# Altium project Dahlia Carrier Board.PrjPcb (part 4 of 4)

## Sheet USB_Debug.SchDoc: Dahlia Carrier Board
size A3; Organization: Toradex AG; Address1: Ebenaustrasse 10; Address2: Horw; Address3: 6048; Address4: Switzerland; DocumentNumber: 19; Revision: V1.1; SheetNumber: 19; SheetTotal: 21; PageSetup: Record=PageOptions|CenterHorizontal=True|CenterVertical=True|PrintScale=0.71|XCorrection=1.00|YCorrection=1.00|PrintKind=1|BorderSize=5000000|LeftOffset=0|BottomOffset=0|Orientation=2|PaperLength=1000|PaperWidth=1000|Scale=100|PaperSource=15|PrintQuality=600|MediaType=1|DitherType=10|PaperKind=A4|PrintScaleMode=1
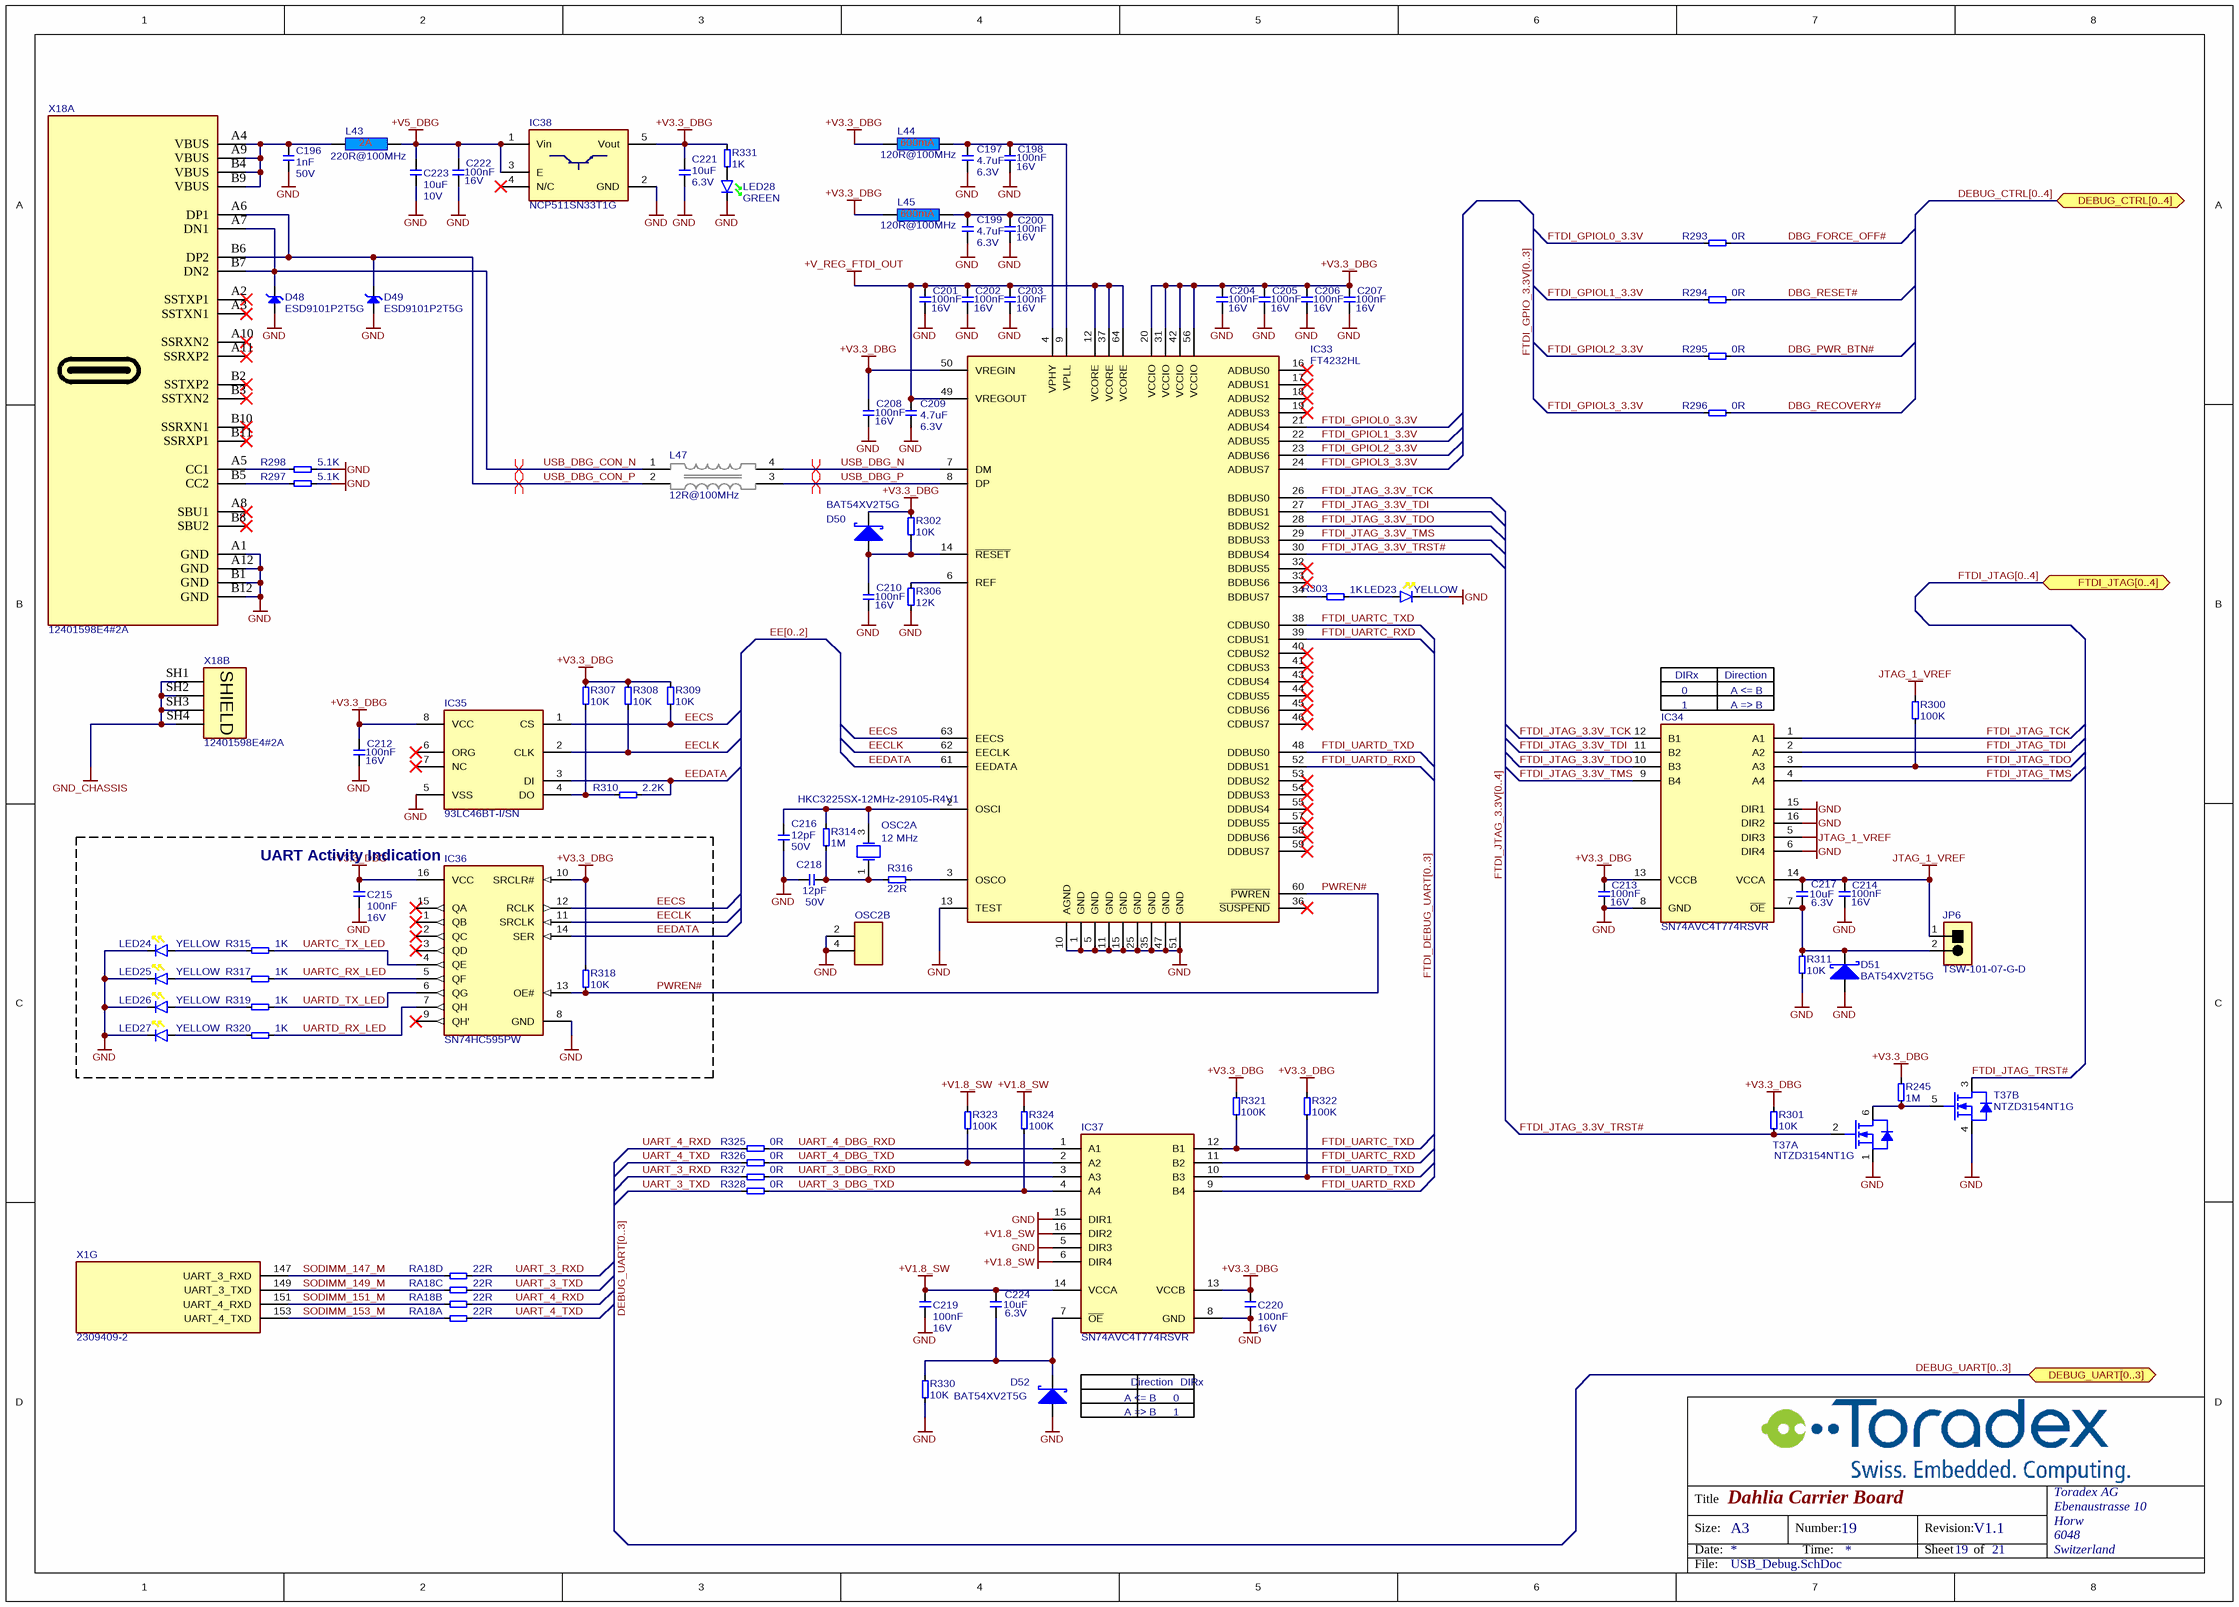
[diagram p17: USB_Debug.SchDoc]

### Parts
C196  Rating: 50V  [CAPC1005X60N]  (hidden comment: 1nF)
C197  Rating: 6.3V  [CAPC1005X60N]  (hidden comment: 4.7uF)
C198  Rating: 16V  [CAPC1005X60N]  (hidden comment: 100nF)
C199  Rating: 6.3V  [CAPC1005X60N]  (hidden comment: 4.7uF)
C200  Rating: 16V  [CAPC1005X60N]  (hidden comment: 100nF)
C201  Rating: 16V  [CAPC1005X60N]  (hidden comment: 100nF)
C202  Rating: 16V  [CAPC1005X60N]  (hidden comment: 100nF)
C203  Rating: 16V  [CAPC1005X60N]  (hidden comment: 100nF)
C204  Rating: 16V  [CAPC1005X60N]  (hidden comment: 100nF)
C205  Rating: 16V  [CAPC1005X60N]  (hidden comment: 100nF)
C206  Rating: 16V  [CAPC1005X60N]  (hidden comment: 100nF)
C207  Rating: 16V  [CAPC1005X60N]  (hidden comment: 100nF)
C208  Rating: 16V  [CAPC1005X60N]  (hidden comment: 100nF)
C209  Rating: 6.3V  [CAPC1005X60N]  (hidden comment: 4.7uF)
C210  Rating: 16V  [CAPC1005X60N]  (hidden comment: 100nF)
C212  Rating: 16V  [CAPC1005X60N]  (hidden comment: 100nF)
C213  Rating: 16V  [CAPC1005X60N]  (hidden comment: 100nF)
C214  Rating: 16V  [CAPC1005X60N]  (hidden comment: 100nF)
C215  Rating: 16V  [CAPC1005X60N]  (hidden comment: 100nF)
C216  Rating: 50V  [CAPC1005X60N]  (hidden comment: 12pF)
C217  Rating: 6.3V  [CAPC1005X60N]  (hidden comment: 10uF)
C218  Rating: 50V  [CAPC1005X60N]  (hidden comment: 12pF)
C219  Rating: 16V  [CAPC1005X60N]  (hidden comment: 100nF)
C220  Rating: 16V  [CAPC1005X60N]  (hidden comment: 100nF)
C221  Rating: 6.3V  [CAPC1005X60N]  (hidden comment: 10uF)
C222  Rating: 16V  [CAPC1005X60N]  (hidden comment: 100nF)
C223  Rating: 10V  [T_CAPC0603X33N]  (hidden comment: 10uF)
C224  Rating: 6.3V  [CAPC1005X60N]  (hidden comment: 10uF)
D48  ESD9101P2T5G  [SOD-923]
D49  ESD9101P2T5G  [SOD-923]
D50  BAT54XV2T5G  [SOD-523]
D51  BAT54XV2T5G  [SOD-523]
D52  BAT54XV2T5G  [SOD-523]
IC33  FT4232HL  [LQFP-64]
IC34  SN74AVC4T774RSVR  [IC-UQFN40P180X210X55-16N]
IC35  Manufacturer Part No.: 93LC46BT-I/SN  [SOIC127P600X173-8N]  (hidden comment: 93LC46BT)
IC36  SN74HC595PW  [IC_TSOP65P640X120-16N]
IC37  SN74AVC4T774RSVR  [IC-UQFN40P180X210X55-16N]
IC38  NCP511SN33T1G  [SOT95P279X142-5N]
JP6  TSW-101-07-G-D  [T_Samtec_TSW-101-07-G-D]
L43  220R@100MHz  [INDC1608X95N]
L44  120R@100MHz  [INDC1005X60N]
L45  120R@100MHz  [INDC1005X60N]
L47  12R@100MHz  [T_Panasonic_EXC14CH120U]
LED23  Color: YELLOW  [T_Liteon_LTST-C190KSKT]  (hidden comment: LTST-C190KSKT)
LED24  Color: YELLOW  [T_Liteon_LTST-C190KSKT]  (hidden comment: LTST-C190KSKT)
LED25  Color: YELLOW  [T_Liteon_LTST-C190KSKT]  (hidden comment: LTST-C190KSKT)
LED26  Color: YELLOW  [T_Liteon_LTST-C190KSKT]  (hidden comment: LTST-C190KSKT)
LED27  Color: YELLOW  [T_Liteon_LTST-C190KSKT]  (hidden comment: LTST-C190KSKT)
LED28  Color: GREEN  [T_Liteon_LTST-C190GKT]  (hidden comment: LTST-C190GKT)
OSC2  HKC3225SX-12MHz-29105-R4V1  value 12 MHz  [OSC-SMD-3.2mmx2.5mm]  (parts A,B of 2)
R245  1M  [RESC1005X40N]
R293  0R  [T_RESC0603X30N]
R294  0R  [T_RESC0603X30N]
R295  0R  [T_RESC0603X30N]
R296  0R  [T_RESC0603X30N]
R297  5.1K  [T_RESC0603X30N]
R298  5.1K  [T_RESC0603X30N]
R300  100K  [RESC1005X40N]
R301  10K  [RESC1005X40N]
R302  10K  [RESC1005X40N]
R303  1K  [RESC1005X40N]
R306  12K  [RESC1005X40N]
R307  10K  [RESC1005X40N]
R308  10K  [RESC1005X40N]
R309  10K  [RESC1005X40N]
R310  2.2K  [RESC1005X40N]
R311  10K  [RESC1005X40N]
R314  value 1M  [T_RESC0603X30N]  (hidden comment: 1MR)
R315  1K  [RESC1005X40N]
R316  22R  [RESC1005X40N]
R317  1K  [RESC1005X40N]
R318  10K  [RESC1005X40N]
R319  1K  [RESC1005X40N]
R320  1K  [RESC1005X40N]
R321  100K  [RESC1005X40N]
R322  100K  [RESC1005X40N]
R323  100K  [RESC1005X40N]
R324  100K  [RESC1005X40N]
R325  0R  [T_RESC0603X30N]
R326  0R  [T_RESC0603X30N]
R327  0R  [T_RESC0603X30N]
R328  0R  [T_RESC0603X30N]
R330  10K  [RESC1005X40N]
R331  1K  [RESC1005X40N]
RA18  22R  [T_Resistor_Array_X4]  (parts A,B,C,D of 4)
T37  Manufacturer Part No.: NTZD3154NT1G  [SOTFL50P160X60-6N]  (hidden comment: T-ONSemi-NTZD3154NT1G)  (parts A,B of 2)
X1  2309409-2  [CON-TE-2309409-2-SOLDERABLE-STANDOFFS]  (part G of 23)
X18  12401598E4#2A  [CON-AMPHENOL-12401598E4#2A]  (parts A,B of 2)

### Blocks framed on the sheet
UART Activity Indication: C215 IC36 LED24-LED27 R315 R317-R320

### Ports
DEBUG_CTRL[0..4] (bidir), DEBUG_UART[0..3] (bidir), FTDI_JTAG[0..4] (bidir)

### Nets
+V1.8_SW: C219.2 C224.2 IC37.6(DIR4) IC37.14(VCCA) IC37.16(DIR2) R323.1 R324.2
+V3.3_DBG: C204.2 C205.2 C206.2 C207.2 C208.2 C212.2 C213.2 C215.2 C220.2 C221.2 D50.C IC33.20(VCCIO) IC33.31(VCCIO) IC33.42(VCCIO) IC33.50(VREGIN) IC33.56(VCCIO) IC34.13(VCCB) IC35.8(VCC) IC36.10(SRCLR#) IC36.16(VCC) IC37.13(VCCB) IC38.5(Vout) L44.1 L45.1 R245.2 R301.2 R302.2 R307.2 R308.2 R309.2 R318.2 R321.1 R322.2 R331.2
+V5_DBG: C222.2 C223.2 IC38.1(Vin) IC38.3(E) L43.1
+V_REG_FTDI_OUT: C201.2 C202.2 C203.2 C209.2 IC33.12(VCORE) IC33.37(VCORE) IC33.49(VREGOUT) IC33.64(VCORE)
GND: C196.1 C197.1 C198.1 C199.1 C200.1 C201.1 C202.1 C203.1 C204.1 C205.1 C206.1 C207.1 C208.1 C209.1 C210.1 C212.1 C213.1 C214.1 C215.1 C216.2 C218.1 C219.1 C220.1 C221.1 C222.1 C223.1 D48.2(A) D49.2(A) D51.A D52.A IC33.1(GND) IC33.5(GND) IC33.10(AGND) IC33.11(GND) IC33.13(TEST) IC33.15(GND) IC33.25(GND) IC33.35(GND) IC33.47(GND) IC33.51(GND) IC34.6(DIR4) IC34.8(GND) IC34.15(DIR1) IC34.16(DIR2) IC35.5(VSS) IC36.8(GND) IC37.5(DIR3) IC37.8(GND) IC37.15(DIR1) IC38.2(GND) LED23.K LED24.K LED25.K LED26.K LED27.K LED28.K OSC2.2(OSC2) OSC2.4(OSC3) R297.1 R298.1 R306.1 R311.1 R330.1 T37.1(S) T37.4(S) X18.A1(GND) X18.A12(GND) X18.B1(GND) X18.B12(GND)
GND_CHASSIS: X18.SH1(SHIELD) X18.SH2(SHIELD) X18.SH3(SHIELD) X18.SH4(SHIELD)
JTAG_1_VREF: C214.2 C217.2 IC34.5(DIR3) IC34.14(VCCA) JP6.1 R300.2
DBG_FORCE_OFF#: R293.2
DBG_PWR_BTN#: R295.2
DBG_RECOVERY#: R296.2
DBG_RESET#: R294.2
EECLK: IC33.62(EECLK) IC35.2(CLK) IC36.11(SRCLK) R308.1
EECS: IC33.63(EECS) IC35.1(CS) IC36.12(RCLK) R309.1
EEDATA: IC33.61(EEDATA) IC35.3(DI) IC36.14(SER) R310.2
FTDI_GPIOL0_3.3V: IC33.21(ADBUS4) R293.1
FTDI_GPIOL1_3.3V: IC33.22(ADBUS5) R294.1
FTDI_GPIOL2_3.3V: IC33.23(ADBUS6) R295.1
FTDI_GPIOL3_3.3V: IC33.24(ADBUS7) R296.1
FTDI_JTAG_3.3V_TCK: IC33.26(BDBUS0) IC34.12(B1)
FTDI_JTAG_3.3V_TDI: IC33.27(BDBUS1) IC34.11(B2)
FTDI_JTAG_3.3V_TDO: IC33.28(BDBUS2) IC34.10(B3)
FTDI_JTAG_3.3V_TMS: IC33.29(BDBUS3) IC34.9(B4)
FTDI_JTAG_3.3V_TRST#: IC33.30(BDBUS4) R301.1 T37.2(G)
FTDI_JTAG_TCK: IC34.1(A1)
FTDI_JTAG_TDI: IC34.2(A2)
FTDI_JTAG_TDO: IC34.3(A3) R300.1
FTDI_JTAG_TMS: IC34.4(A4)
FTDI_JTAG_TRST#: T37.3(D)
FTDI_UARTC_RXD: IC33.39(CDBUS1) IC37.11(B2)
FTDI_UARTC_TXD: IC33.38(CDBUS0) IC37.12(B1) R321.2
FTDI_UARTD_RXD: IC33.52(DDBUS1) IC37.9(B4)
FTDI_UARTD_TXD: IC33.48(DDBUS0) IC37.10(B3) R322.1
PWREN#: IC33.60(~{PWREN}) IC36.13(OE#) R318.1
SODIMM_147_M: RA18.4 X1.147(UART_3_RXD)
SODIMM_149_M: RA18.3 X1.149(UART_3_TXD)
SODIMM_151_M: RA18.2 X1.151(UART_4_RXD)
SODIMM_153_M: RA18.1 X1.153(UART_4_TXD)
UART_3_DBG_RXD: IC37.3(A3) R327.2
UART_3_DBG_TXD: IC37.4(A4) R324.1 R328.2
UART_3_RXD: R327.1 RA18.8
UART_3_TXD: R328.1 RA18.7
UART_4_DBG_RXD: IC37.1(A1) R325.2
UART_4_DBG_TXD: IC37.2(A2) R323.2 R326.2
UART_4_RXD: R325.1 RA18.6
UART_4_TXD: R326.1 RA18.5
UARTC_RX_LED: IC36.5(QF) R317.2
UARTC_TX_LED: IC36.4(QE) R315.2
UARTD_RX_LED: IC36.7(QH) R320.2
UARTD_TX_LED: IC36.6(QG) R319.2
USB_DBG_CON_N: D48.1(C) L47.1 X18.A7(DN1) X18.B7(DN2)
USB_DBG_CON_P: D49.1(C) L47.2 X18.A6(DP1) X18.B6(DP2)
USB_DBG_N: IC33.7(DM) L47.4
USB_DBG_P: IC33.8(DP) L47.3
NetC196_2: C196.2 L43.2 X18.A4(VBUS) X18.A9(VBUS) X18.B4(VBUS) X18.B9(VBUS)
NetC197_2: C197.2 C198.2 IC33.9(VPLL) L44.2
NetC199_2: C199.2 C200.2 IC33.4(VPHY) L45.2
NetC210_2: C210.2 D50.A IC33.14(~{RESET}) R302.1
NetC216_1: C216.1 IC33.2(OSCI) OSC2.3(OSC2) R314.2
NetC217_1: C217.1 D51.C IC34.7(~{OE}) JP6.2 R311.2
NetC218_2: C218.2 OSC2.1(OSC1) R314.1 R316.2
NetC224_1: C224.1 D52.C IC37.7(~{OE}) R330.2
NetIC33_3: IC33.3(OSCO) R316.1
NetIC33_6: IC33.6(REF) R306.2
NetIC33_34: IC33.34(BDBUS7) R303.2
NetIC35_4: IC35.4(DO) R307.1 R310.1
NetLED23_A: LED23.A R303.1
NetLED24_A: LED24.A R315.1
NetLED25_A: LED25.A R317.1
NetLED26_A: LED26.A R319.1
NetLED27_A: LED27.A R320.1
NetLED28_A: LED28.A R331.1
NetR245_1: R245.1 T37.5(G) T37.6(D)
NetR297_2: R297.2 X18.B5(CC2)
NetR298_2: R298.2 X18.A5(CC1)

Not connected (* = marked no-connect by the designer): IC33 16(ADBUS0)* 17(ADBUS1)* 18(ADBUS2)* 19(ADBUS3)* 32(BDBUS5)* 33(BDBUS6)* 36(~{SUSPEND})* 40(CDBUS2)* 41(CDBUS3)* 43(CDBUS4)* 44(CDBUS5)* 45(CDBUS6)* 46(CDBUS7)* 53(DDBUS2)* 54(DDBUS3)* 55(DDBUS4)* 57(DDBUS5)* 58(DDBUS6)* 59(DDBUS7)*; IC35 6(ORG)* 7(NC)*; IC36 1(QB)* 2(QC)* 3(QD)* 9(QH')* 15(QA)*; IC38 4(N/C)*; X18 A2(SSTXP1)* A3(SSTXN1)* A8(SBU1)* A10(SSRXN2)* A11(SSRXP2)* B2(SSTXP2)* B3(SSTXN2)* B8(SBU2)* B10(SSRXN1)* B11(SSRXP1)*

### Buses and harness runs
bus DEBUG_CTRL[0..4] = port DEBUG_CTRL[0..4]
bus DEBUG_UART[0..3] = port DEBUG_UART[0..3]
bus EE[0..2]
bus FTDI_DEBUG_UART[0..3]
bus FTDI_GPIO_3.3V[0..3]
bus FTDI_JTAG[0..4] = port FTDI_JTAG[0..4]
bus FTDI_JTAG_3.3V[0..4]

### Layout directives
differential pair; differential pair class USB: USB_DBG_CON_N, USB_DBG_CON_P, USB_DBG_N, USB_DBG_P

### Notes on the sheet
- DIRx
- (near IC34) 0
- (near IC34) 1
- Direction
- (near IC34) A <= B
- (near IC34) A => B
- (near D52) A <= B
- (near D52) A => B
- (near D52) Direction
- 0
- 1
- (near IC37) DIRx
- Title
- Size:
- Date:
- A3
- Number:
- Time:
- Revision:
- Sheet
- of
- File:

### Library data of the parts
C196 = C-X7R-1nF-50V-10%-0402: Capacitor Ceramic X7R 1nF 50V 10% 0402; Tolerance: 10%; Type: X7R; Value: 1nF
C197 C199 C209 = C-X5R-4.7u-6.3V-20%-0402: Capacitor Ceramic X5R 4.7uF 6.3V 20% 0402; Tolerance: 20%; Type: X5R; Value: 4.7uF
C198 C200-C208 C210 C212-C215 C219 C220 C222 = C-X7R-100nF-16V-10%-0402: Capacitor Ceramic X7R 100nF 16V 10% 0402; Tolerance: 10%; Type: X7R; Value: 100nF
C216 C218 = C-NP0-12p-50V-5%-0402: Capacitor Ceramic NP0  12pF 50V 5% 0402; Tolerance: 5%; Type: NP0; Value: 12pF
C217 C221 C224 = C-X5R-10u-6.3V-20%-0402: Capacitor Ceramic X5R 10uF 6.3V 20% 0402; Tolerance: 20%; Type: X5R; Value: 10uF
C223 = C-X5R-10uF-10V-20%-0603: Capacitor Ceramic X5R 10uF 10V 20% 0603; Tolerance: 20%; Type: X5R; Value: 10uF
D48 D49 = D-OnSemi-ESD9101P2T5G: ESD Protection Diode; Manufacturer Name: OnSemi; Manufacturer Part No.: ESD9101P2T5G
D50-D52 = D-BAT54-SOD523: as D38 on sheet PCI_Express; Manufacturer Part No.: BAT54XV2T5G
IC33 = IC-FTDI-FT4232HL: Quad High Speed USB to Multipurpose UART/MPSSE; Manufacturer Name: FTDI; Note: Quad USB to UART; Manufacturer Part No.: FT4232HL
IC34 IC37 = IC-TI-SN74AVC4T774RSVR: 4 Bit Bidirectional l Voltage Level Translator, Configurable Direction, UFQFN-16 package; Manufacturer Name: Texas Instruments; Manufacturer Part No.: SN74AVC4T774RSVR
IC35 = IC-MC-93LC46BT-I/SN: EEPROM, 1k, 64x16, serial, SOIC8; Manufacturer Name: Microchip
IC36 = IC-TI-SN74HC595PW: 8-Bit Shift Registers With 3-State Output Registers; Manufacturer Name: Texas Instruments; Manufacturer Part No.: SN74HC595PW
IC38 = IC-ON-NCP511SN33T1G: NCP511SN33T1G LDO Regulator; Manufacturer Name: ON Semiconductor; Manufacturer Part No.: NCP511SN33T1G
JP6 = CON-Samtec-TSW-101-07-G-D: Header male, 1x2 Pins, 2.54 mm pitch; Manufacturer Name: Samtec; Pitch: 2.54 mm; No. of ways: 1x2; Manufacturer Part no.: TSW-101-07-G-D
L43 = L-220R@100MHz-2A-25%-0603: 220R@100MHz 2A EMI FILTER; Tolerance: 25%; Rating: 2A; Value: 220R@100MHz
L44 L45 = Lemv-120R-600mA-25%-0402: 120R@100MHz 600mA EMI FILTER; Tolerance: 25%; Rating: 600mA; Value: 120R@100MHz
L47 = L-Panasonic-EXC14CH120U-12R@100MHz-1000mA-25%: as L33-L37 on sheet MIPI-CSI; Rating: 100mA; Manufacturer Name: Panasonic; Manufacturer Part No.: EXC14CH120U; Value: 12R@100MHz
LED23-LED27 = LED-LiteOn-LTST-C190KSKT: LED yellow Lite-On LTST-C190KSKT; Manufacturer Name: Lite-On; Manufacturer Part No.: LTST-C190KSKT
LED28 = LED-LiteOn-LTST-C190GKT: LED green Lite-ON LTST-C190GKT; Manufacturer Name: Lite-ON; Manufacturer Part No.: LTST-C190GKT
OSC2 = OSC-HKC-HKC3225SX-12MHz-29105-R4V1: 12MHz Ceramic SMD Crystal, Hong Kong X’tals Limited, HKC3225SX-12MHz-29105-R4V1, 30ppm, -40C to +85C; Tolerance: +/- 30 ppm; Manufacturer Name: Hong Kong X’tals Limited; Package: 3.2mm X 2.5mm; Temperature Range: -40C to +85C; Manufacturer Part No.: HKC3225SX-12MHz-29105-R4V1
R245 = R-1M-63mW-5%-0402: Resistor 1 Mohm 63mW 5% 0402; Rating: 63mW; Tolerance: 5%; Value: 1M
R293-R296 R325-R328 = R-0R-63mW-1%-0603: Resistor 0 ohm 63mW 1% 0603; Rating: 63mW; Tolerance: 1%; Value: 0R
R297 R298 = R-5.1K-63mW-1%-0603: Resistor 5.1 Kohm 63mW 1% 0603; Rating: 63mW; Tolerance: 1%; Value: 5.1K
R300 R321-R324 = R-100K-63mW-5%-0402: Resistor 100 Kohm 63mW 5% 0402; Rating: 63mW; Tolerance: 5%; Value: 100K
R301 R302 R307-R309 R311 R318 R330 = R-10K-63mW-5%-0402: Resistor 10 Kohm 63mW 5% 0402; Rating: 63mW; Tolerance: 5%; Value: 10K
R303 R315 R317 R319 R320 R331 = R-1K-63mW-5%-0402: Resistor 1 Kohm 63mW 5% 0402; Rating: 63mW; Tolerance: 5%; Value: 1K
R306 = R-12K-63mW-1%-0402: Resistor 12 Kohm 63mW 1% 0402; Rating: 63mW; Tolerance: 1%; Value: 12K
R310 = R-2.2K-63mW-5%-0402: Resistor 2.2 Kohm 63mW 5% 0402; Value: 2.2KR; Rating: 63mW; Tolerance: 5%
R314 = R-1M-63mW-5%-0603: Resistor 1Mohm 63mW 5% 0603; Rating: 63mW; Tolerance: 5%
R316 = R-22R-63mW-5%-0402: Resistor 22 ohm 63mW 5% 0402; Rating: 63mW; Tolerance: 5%; Value: 22R
RA18 = RA-22R-63mW-5%-1206-div: Resistor Array 22 R 63mW 5% 1206; Tolerance: 5%; Power Dissipation: 63mW; Value: 22R
T37 = T-ONSemi-NTZD3154NT1G: Dual N-Channel 20V (D-S)  MOSFET; Manufacturer Name: ONSemi
X1 = CON-TE-2309409-2: as X1 on sheet PCI_Express; Temperature Range: -40C to +125C; Package: DDR4-SODIMM-260; Manufacturer Part No.: 2309409-2
X18 = CON-Amphenol-12401598E4#2A: USB 3.1 Gen 2, Input Output Connectors, USB type C, Receptacle, Top mount, dual-row SMT, 1.6mmPCB; No. of ways: 24; Manufacturer Name: Amphenol; Manufacturer Part No.: 12401598E4#2A

## Sheet Extension.SchDoc: Dahlia Carrier Board
size A3; Organization: Toradex AG; Address1: Ebenaustrasse 10; Address2: Horw; Address3: 6048; Address4: Switzerland; DocumentNumber: 18; Revision: V1.1; SheetNumber: 18; SheetTotal: 21; PageSetup: Record=PageOptions|CenterHorizontal=True|CenterVertical=True|PrintScale=0.71|XCorrection=1.00|YCorrection=1.00|PrintKind=1|BorderSize=5000000|LeftOffset=0|BottomOffset=0|Orientation=2|PaperLength=1000|PaperWidth=1000|Scale=100|PaperSource=15|PrintQuality=600|MediaType=1|DitherType=10|PaperKind=A4|PrintScaleMode=1
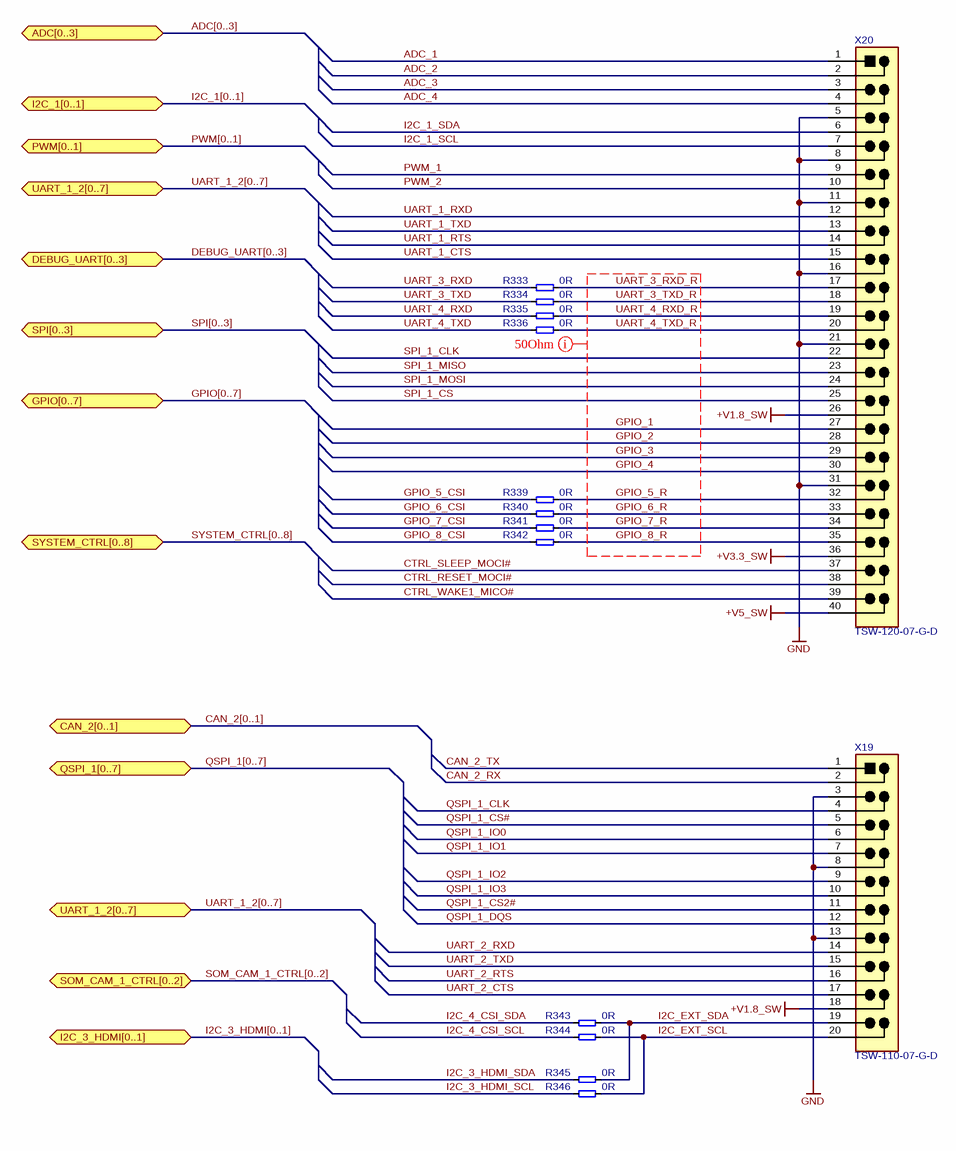
[diagram p18: Extension.SchDoc]

### Parts
R333  0R  [T_RESC0603X30N]
R334  0R  [T_RESC0603X30N]
R335  0R  [T_RESC0603X30N]
R336  0R  [T_RESC0603X30N]
R339  0R  [T_RESC0603X30N]
R340  0R  [T_RESC0603X30N]
R341  0R  [T_RESC0603X30N]
R342  0R  [T_RESC0603X30N]
R343  0R  [T_RESC0603X30N]
R344  0R  [T_RESC0603X30N]
R345  0R  [T_RESC0603X30N]
R346  0R  [T_RESC0603X30N]
X19  TSW-110-07-G-D  [T_Samtec_TSW-110-07-G-D]
X20  TSW-120-07-G-D  [T_Samtec_TSW-120-07-G-D]

### Ports
ADC[0..3] (bidir), CAN_2[0..1] (bidir), DEBUG_UART[0..3] (bidir), GPIO[0..7] (bidir), I2C_1[0..1] (bidir), I2C_3_HDMI[0..1] (bidir), PWM[0..1] (bidir), QSPI_1[0..7] (bidir), SOM_CAM_1_CTRL[0..2] (bidir), SPI[0..3] (bidir), SYSTEM_CTRL[0..8] (bidir), UART_1_2[0..7] (bidir)

### Nets
+V1.8_SW: X19.18 X20.26
+V3.3_SW: X20.36
+V5_SW: X20.40
GND: X19.3 X19.8 X19.13 X20.5 X20.8 X20.11 X20.16 X20.21 X20.31
ADC_1: X20.1
ADC_2: X20.2
ADC_3: X20.3
ADC_4: X20.4
CAN_2_RX: X19.2
CAN_2_TX: X19.1
CTRL_RESET_MOCI#: X20.38
CTRL_SLEEP_MOCI#: X20.37
CTRL_WAKE1_MICO#: X20.39
GPIO_1: X20.27
GPIO_2: X20.28
GPIO_3: X20.29
GPIO_4: X20.30
GPIO_5_CSI: R339.2
GPIO_5_R: R339.1 X20.32
GPIO_6_CSI: R340.2
GPIO_6_R: R340.1 X20.33
GPIO_7_CSI: R341.2
GPIO_7_R: R341.1 X20.34
GPIO_8_CSI: R342.2
GPIO_8_R: R342.1 X20.35
I2C_1_SCL: X20.7
I2C_1_SDA: X20.6
I2C_3_HDMI_SCL: R346.2
I2C_3_HDMI_SDA: R345.2
I2C_4_CSI_SCL: R344.2
I2C_4_CSI_SDA: R343.2
I2C_EXT_SCL: R344.1 R346.1 X19.20
I2C_EXT_SDA: R343.1 R345.1 X19.19
PWM_1: X20.9
PWM_2: X20.10
QSPI_1_CLK: X19.4
QSPI_1_CS2#: X19.11
QSPI_1_CS#: X19.5
QSPI_1_DQS: X19.12
QSPI_1_IO0: X19.6
QSPI_1_IO1: X19.7
QSPI_1_IO2: X19.9
QSPI_1_IO3: X19.10
SPI_1_CLK: X20.22
SPI_1_CS: X20.25
SPI_1_MISO: X20.23
SPI_1_MOSI: X20.24
UART_1_CTS: X20.15
UART_1_RTS: X20.14
UART_1_RXD: X20.12
UART_1_TXD: X20.13
UART_2_CTS: X19.17
UART_2_RTS: X19.16
UART_2_RXD: X19.14
UART_2_TXD: X19.15
UART_3_RXD: R333.2
UART_3_RXD_R: R333.1 X20.17
UART_3_TXD: R334.2
UART_3_TXD_R: R334.1 X20.18
UART_4_RXD: R335.2
UART_4_RXD_R: R335.1 X20.19
UART_4_TXD: R336.2
UART_4_TXD_R: R336.1 X20.20

### Buses and harness runs
bus ADC[0..3] = port ADC[0..3]
bus CAN_2[0..1] = port CAN_2[0..1]
bus DEBUG_UART[0..3] = port DEBUG_UART[0..3]
bus GPIO[0..7] = port GPIO[0..7]
bus I2C_1[0..1] = port I2C_1[0..1]
bus I2C_3_HDMI[0..1] = port I2C_3_HDMI[0..1]
bus PWM[0..1] = port PWM[0..1]
bus QSPI_1[0..7] = port QSPI_1[0..7]
bus SOM_CAM_1_CTRL[0..2] = port SOM_CAM_1_CTRL[0..2]
bus SPI[0..3] = port SPI[0..3]
bus SYSTEM_CTRL[0..8] = port SYSTEM_CTRL[0..8]
bus UART_1_2[0..7] = port UART_1_2[0..7]

### Layout directives
net class 50Ohm: GPIO_1, GPIO_2, GPIO_3, GPIO_4, GPIO_5_R, GPIO_6_R, GPIO_7_R, GPIO_8_R, UART_3_RXD_R, UART_3_TXD_R, UART_4_RXD_R, UART_4_TXD_R

### Notes on the sheet
- Title
- Size:
- Date:
- A3
- Number:
- Time:
- Revision:
- Sheet
- of
- File:

### Library data of the parts
R333-R336 R339-R346 = R-0R-63mW-1%-0603: Resistor 0 ohm 63mW 1% 0603; Rating: 63mW; Tolerance: 1%; Value: 0R
X19 = CON-Samtec-TSW-110-07-G-D: Header 2x10 pin 2.54mm pitch; Manufacturer Name: Samtec; Pitch: 2.54mm; No. of ways: 2x10; Manufacturer Part No.: TSW-110-07-G-D
X20 = CON-Samtec-TSW-120-07-G-D: Header 2x20 pin 2.54mm pitch; Manufacturer Name: Samtec; Pitch: 2.54mm; No. of ways: 2x20; Manufacturer Part No.: TSW-120-07-G-D

## Sheet Unused_SODIMM.SchDoc: Dahlia Carrier Board
size A3; Organization: Toradex AG; Address1: Ebenaustrasse 10; Address2: Horw; Address3: 6048; Address4: Switzerland; DocumentNumber: 21; Revision: V1.1; SheetNumber: 21; SheetTotal: 21; PageSetup: Record=PageOptions|CenterHorizontal=True|CenterVertical=True|PrintScale=0.71|XCorrection=1.00|YCorrection=1.00|PrintKind=1|BorderSize=5000000|LeftOffset=0|BottomOffset=0|Orientation=2|PaperLength=1000|PaperWidth=1000|Scale=100|PaperSource=15|PrintQuality=600|MediaType=1|DitherType=10|PaperKind=A4|PrintScaleMode=1
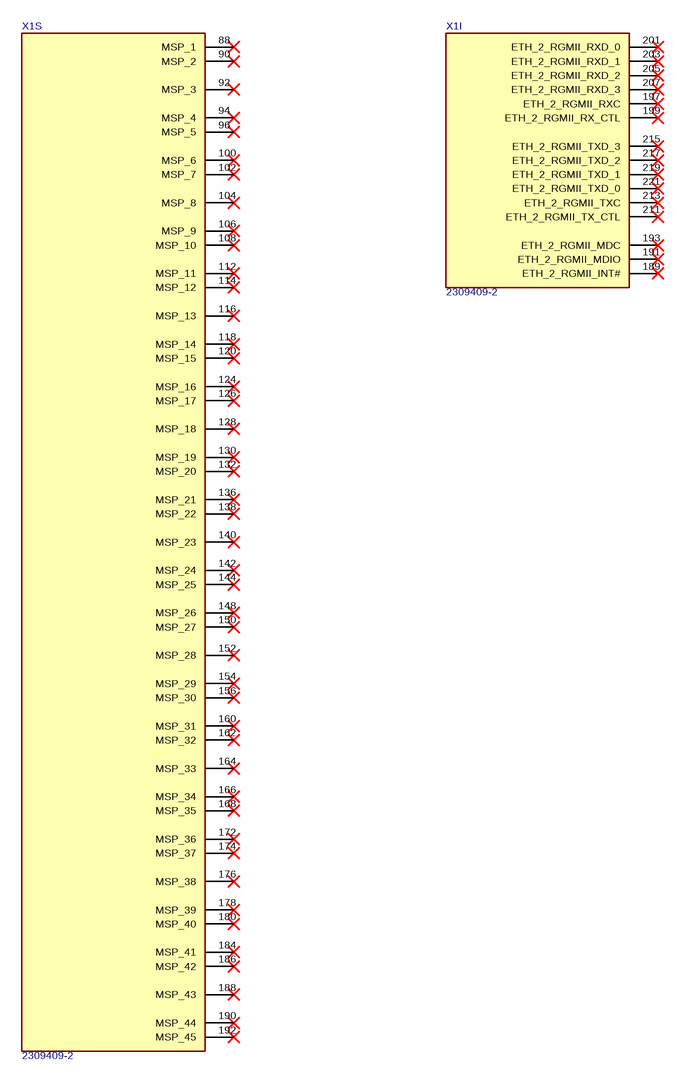
[diagram p19: Unused_SODIMM.SchDoc]

### Parts
X1  2309409-2  [CON-TE-2309409-2-SOLDERABLE-STANDOFFS]  (parts I,S of 23)

### Nets

Not connected (* = marked no-connect by the designer): X1 88(MSP_1)* 90(MSP_2)* 92(MSP_3)* 94(MSP_4)* 96(MSP_5)* 100(MSP_6)* 102(MSP_7)* 104(MSP_8)* 106(MSP_9)* 108(MSP_10)* 112(MSP_11)* 114(MSP_12)* 116(MSP_13)* 118(MSP_14)* 120(MSP_15)* 124(MSP_16)* 126(MSP_17)* 128(MSP_18)* 130(MSP_19)* 132(MSP_20)* 136(MSP_21)* 138(MSP_22)* 140(MSP_23)* 142(MSP_24)* 144(MSP_25)* 148(MSP_26)* 150(MSP_27)* 152(MSP_28)* 154(MSP_29)* 156(MSP_30)* 160(MSP_31)* 162(MSP_32)* 164(MSP_33)* 166(MSP_34)* 168(MSP_35)* 172(MSP_36)* 174(MSP_37)* 176(MSP_38)* 178(MSP_39)* 180(MSP_40)* 184(MSP_41)* 186(MSP_42)* 188(MSP_43)* 189(ETH_2_RGMII_INT#)* 190(MSP_44)* 191(ETH_2_RGMII_MDIO)* 192(MSP_45)* 193(ETH_2_RGMII_MDC)* 197(ETH_2_RGMII_RXC)* 199(ETH_2_RGMII_RX_CTL)* 201(ETH_2_RGMII_RXD_0)* 203(ETH_2_RGMII_RXD_1)* 205(ETH_2_RGMII_RXD_2)* 207(ETH_2_RGMII_RXD_3)* 211(ETH_2_RGMII_TX_CTL)* 213(ETH_2_RGMII_TXC)* 215(ETH_2_RGMII_TXD_3)* 217(ETH_2_RGMII_TXD_2)* 219(ETH_2_RGMII_TXD_1)* 221(ETH_2_RGMII_TXD_0)*

### Notes on the sheet
- Title
- Size:
- Date:
- A3
- Number:
- Time:
- Revision:
- Sheet
- of
- File:

### Library data of the parts
X1 = CON-TE-2309409-2: DDR4 SODIMM Socket, 260 pins, 5.2mm(H), 0.5mm Pitch; Manufacturer Name: TE; Temperature Range: -40C to +125C; Package: DDR4-SODIMM-260; Manufacturer Part No.: 2309409-2

## Sheet HDMI.SchDoc: Dahlia Carrier Board
size A3; Organization: Toradex AG; Address1: Ebenaustrasse 10; Address2: Horw; Address3: 6048; Address4: Switzerland; DocumentNumber: 9; Revision: V1.1; SheetNumber: 9; SheetTotal: 21; PageSetup: Record=PageOptions|CenterHorizontal=True|CenterVertical=True|PrintScale=0.71|XCorrection=1.00|YCorrection=1.00|PrintKind=1|BorderSize=5000000|LeftOffset=0|BottomOffset=0|Orientation=2|PaperLength=1000|PaperWidth=1000|Scale=100|PaperSource=15|PrintQuality=600|MediaType=1|DitherType=10|PaperKind=A4|PrintScaleMode=1
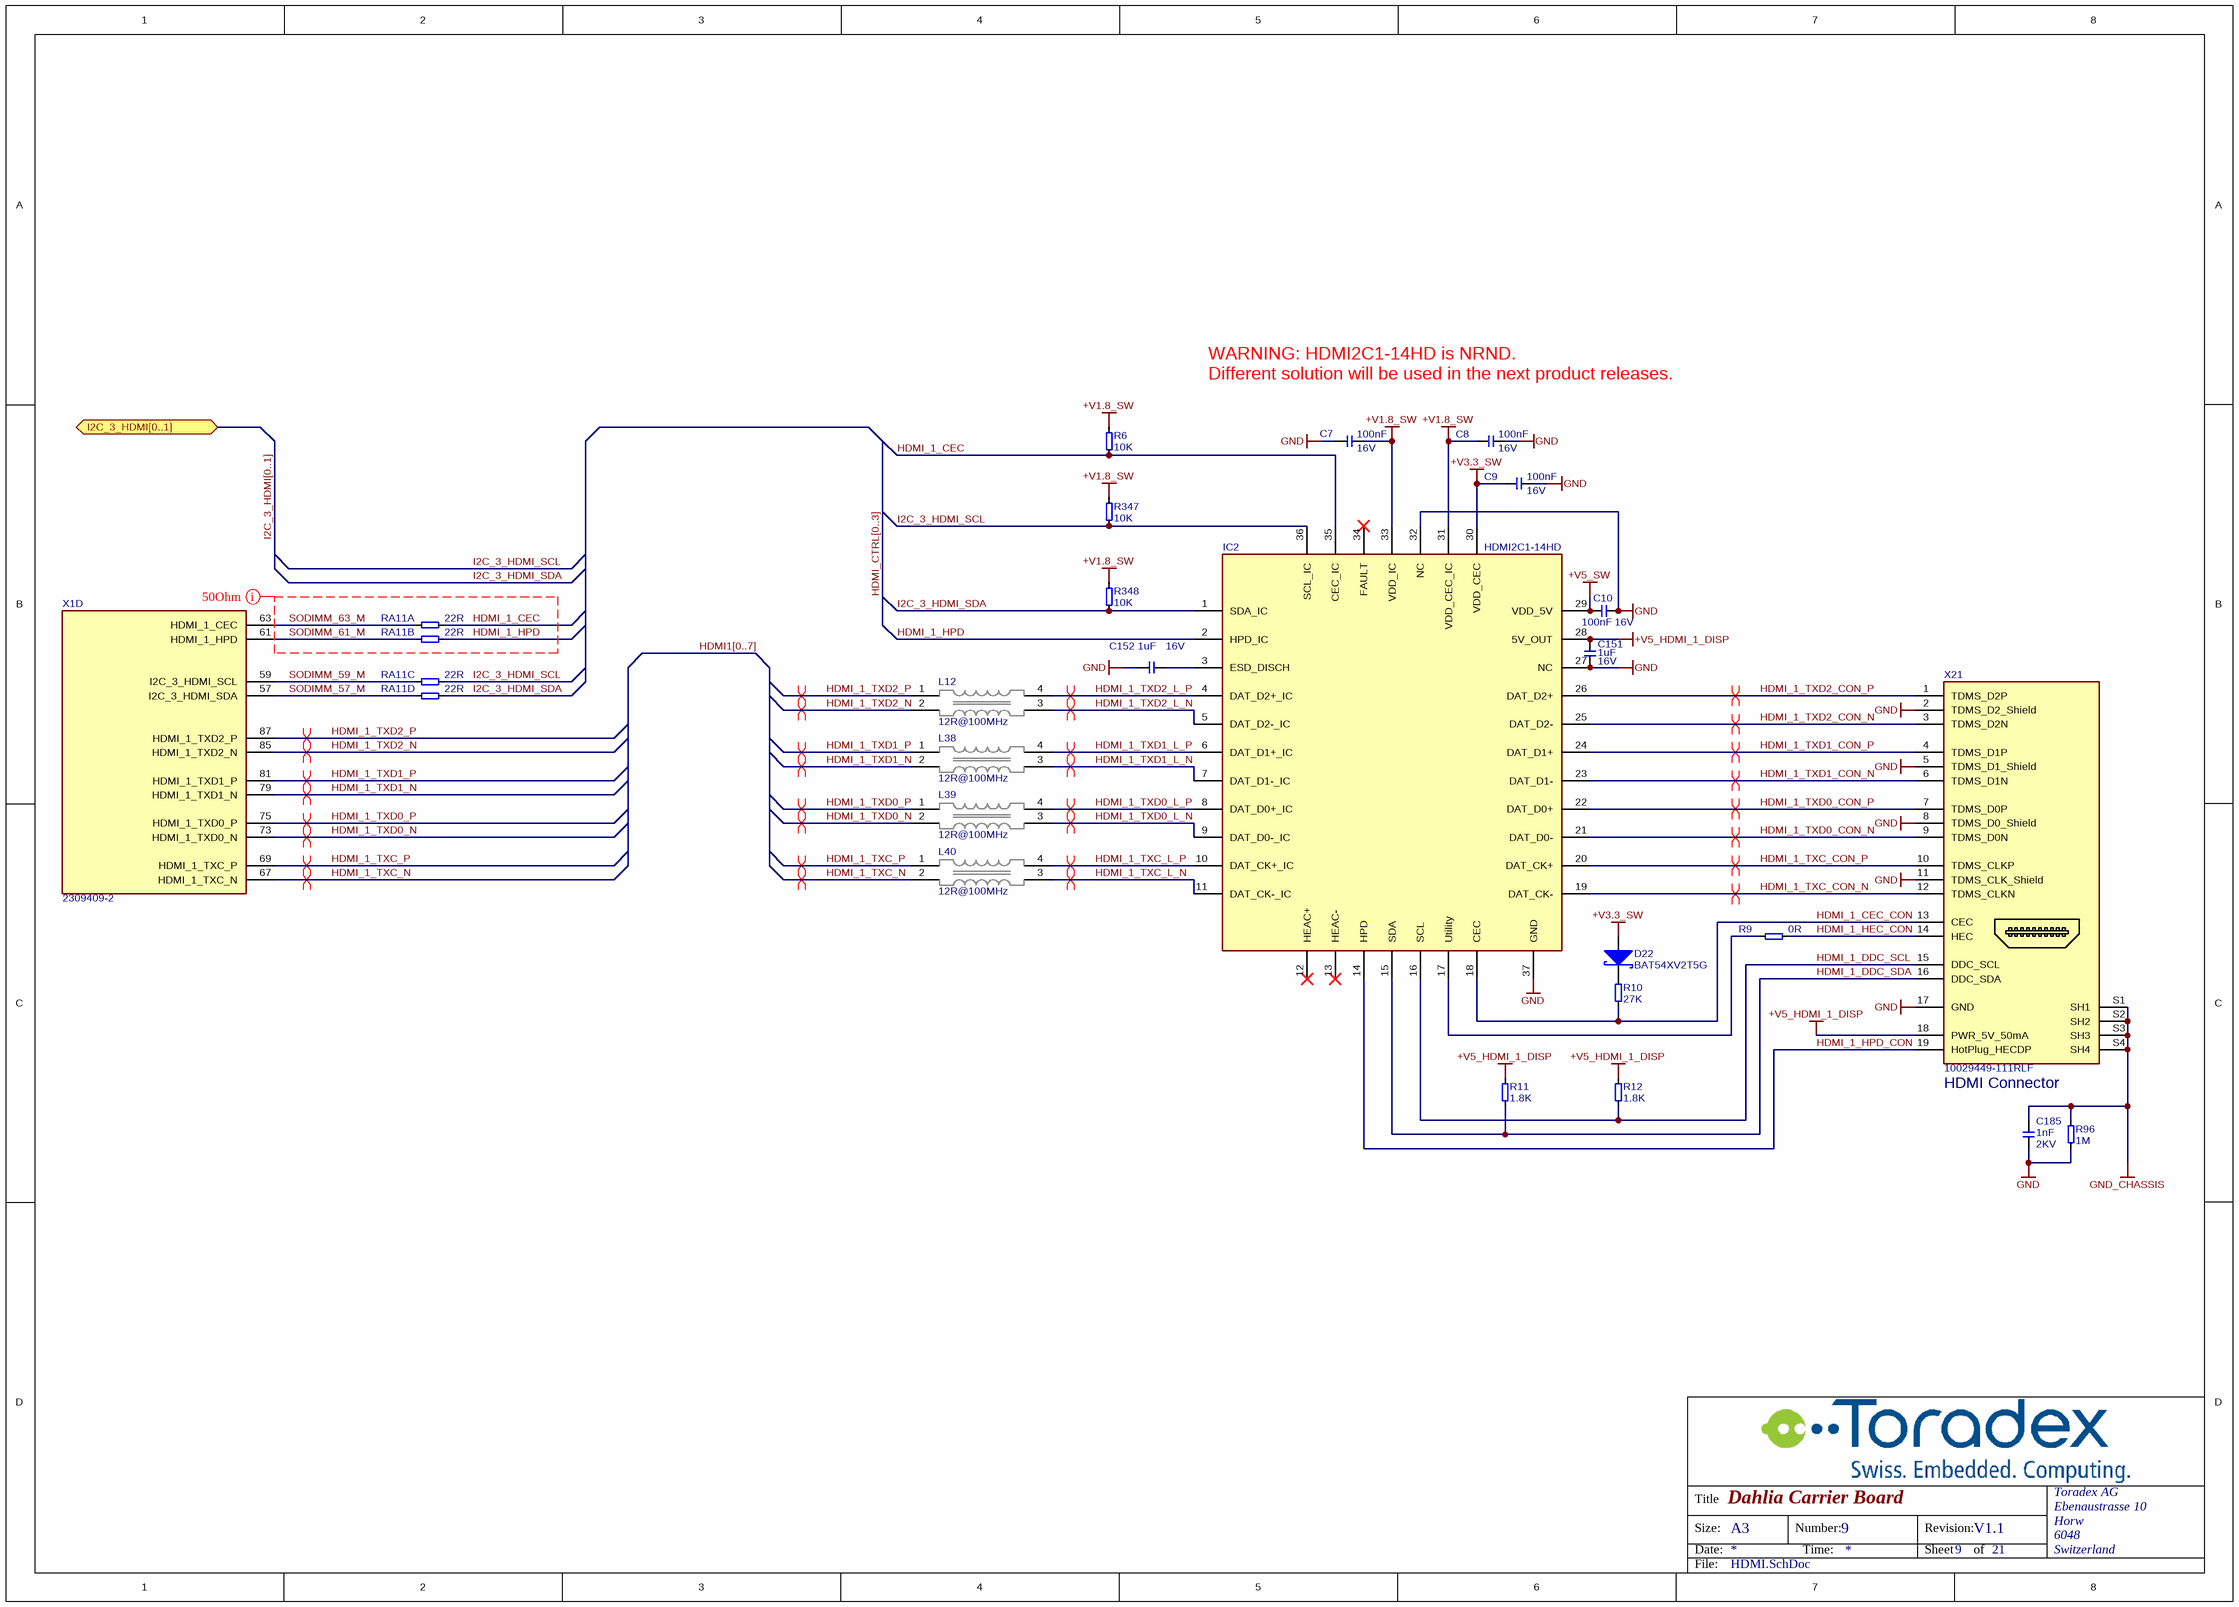
[diagram p20: HDMI.SchDoc]

### Parts
C7  Rating: 16V  [CAPC1005X60N]  (hidden comment: 100nF)
C8  Rating: 16V  [CAPC1005X60N]  (hidden comment: 100nF)
C9  Rating: 16V  [CAPC1005X60N]  (hidden comment: 100nF)
C10  Rating: 16V  [CAPC1005X60N]  (hidden comment: 100nF)
C151  Rating: 16V  [CAPC1005X60N]  (hidden comment: 1uF)
C152  Rating: 16V  [CAPC1005X60N]  (hidden comment: 1uF)
C185  Rating: 2KV  [T_CAPC1206X180N]  (hidden comment: 1nF)
D22  BAT54XV2T5G  [SOD-523]
IC2  HDMI2C1-14HD  [QFN50P350X650X95_HS-37N]
L12  12R@100MHz  [T_Panasonic_EXC14CH120U]
L38  12R@100MHz  [T_Panasonic_EXC14CH120U]
L39  12R@100MHz  [T_Panasonic_EXC14CH120U]
L40  12R@100MHz  [T_Panasonic_EXC14CH120U]
R6  10K  [RESC1005X40N]
R9  0R  [T_RESC0603X30N]
R10  27K  [RESC1005X40N]
R11  1.8K  [RESC1005X40N]
R12  1.8K  [RESC1005X40N]
R96  1M  [RESC3216X75N]
R347  10K  [RESC1005X40N]
R348  10K  [RESC1005X40N]
RA11  22R  [T_Resistor_Array_X4]  (parts A,B,C,D of 4)
X1  2309409-2  [CON-TE-2309409-2-SOLDERABLE-STANDOFFS]  (part D of 23)
X21  10029449-111RLF  [T_FCI_10029449-111RLF]

### Ports
I2C_3_HDMI[0..1] (bidir)

### Nets
+V1.8_SW: C7.2 C8.1 IC2.31(VDD_CEC_IC) IC2.33(VDD_IC) R6.2 R347.1 R348.1
+V3.3_SW: C9.2 D22.A IC2.30(VDD_CEC)
+V5_HDMI_1_DISP: C151.2 IC2.28(5V_OUT) R11.2 R12.2 X21.18(PWR_5V_50mA)
+V5_SW: C10.2 IC2.29(VDD_5V)
GND: C7.1 C8.2 C9.1 C10.1 C151.1 C152.2 C185.1 IC2.27(NC) IC2.32(NC) IC2.37(GND) R96.1 X21.2(TDMS_D2_Shield) X21.5(TDMS_D1_Shield) X21.8(TDMS_D0_Shield) X21.11(TDMS_CLK_Shield) X21.17(GND)
GND_CHASSIS: C185.2 R96.2 X21.S1(SH1) X21.S2(SH2) X21.S3(SH3) X21.S4(SH4)
HDMI_1_CEC: IC2.35(CEC_IC) R6.1 RA11.5
HDMI_1_CEC_CON: IC2.18(CEC) R10.1 X21.13(CEC)
HDMI_1_DDC_SCL: IC2.16(SCL) R12.1 X21.15(DDC_SCL)
HDMI_1_DDC_SDA: IC2.15(SDA) R11.1 X21.16(DDC_SDA)
HDMI_1_HEC_CON: R9.2 X21.14(HEC)
HDMI_1_HPD: IC2.2(HPD_IC) RA11.6
HDMI_1_HPD_CON: IC2.14(HPD) X21.19(HotPlug_HECDP)
HDMI_1_TXC_CON_N: IC2.19(DAT_CK-) X21.12(TDMS_CLKN)
HDMI_1_TXC_CON_P: IC2.20(DAT_CK+) X21.10(TDMS_CLKP)
HDMI_1_TXC_L_N: IC2.11(DAT_CK-_IC) L40.3
HDMI_1_TXC_L_P: IC2.10(DAT_CK+_IC) L40.4
HDMI_1_TXC_N: L40.2 X1.67(HDMI_1_TXC_N)
HDMI_1_TXC_P: L40.1 X1.69(HDMI_1_TXC_P)
HDMI_1_TXD0_CON_N: IC2.21(DAT_D0-) X21.9(TDMS_D0N)
HDMI_1_TXD0_CON_P: IC2.22(DAT_D0+) X21.7(TDMS_D0P)
HDMI_1_TXD0_L_N: IC2.9(DAT_D0-_IC) L39.3
HDMI_1_TXD0_L_P: IC2.8(DAT_D0+_IC) L39.4
HDMI_1_TXD0_N: L39.2 X1.73(HDMI_1_TXD0_N)
HDMI_1_TXD0_P: L39.1 X1.75(HDMI_1_TXD0_P)
HDMI_1_TXD1_CON_N: IC2.23(DAT_D1-) X21.6(TDMS_D1N)
HDMI_1_TXD1_CON_P: IC2.24(DAT_D1+) X21.4(TDMS_D1P)
HDMI_1_TXD1_L_N: IC2.7(DAT_D1-_IC) L38.3
HDMI_1_TXD1_L_P: IC2.6(DAT_D1+_IC) L38.4
HDMI_1_TXD1_N: L38.2 X1.79(HDMI_1_TXD1_N)
HDMI_1_TXD1_P: L38.1 X1.81(HDMI_1_TXD1_P)
HDMI_1_TXD2_CON_N: IC2.25(DAT_D2-) X21.3(TDMS_D2N)
HDMI_1_TXD2_CON_P: IC2.26(DAT_D2+) X21.1(TDMS_D2P)
HDMI_1_TXD2_L_N: IC2.5(DAT_D2-_IC) L12.3
HDMI_1_TXD2_L_P: IC2.4(DAT_D2+_IC) L12.4
HDMI_1_TXD2_N: L12.2 X1.85(HDMI_1_TXD2_N)
HDMI_1_TXD2_P: L12.1 X1.87(HDMI_1_TXD2_P)
I2C_3_HDMI_SCL: IC2.36(SCL_IC) R347.2 RA11.7
I2C_3_HDMI_SDA: IC2.1(SDA_IC) R348.2 RA11.8
SODIMM_57_M: RA11.4 X1.57(I2C_3_HDMI_SDA)
SODIMM_59_M: RA11.3 X1.59(I2C_3_HDMI_SCL)
SODIMM_61_M: RA11.2 X1.61(HDMI_1_HPD)
SODIMM_63_M: RA11.1 X1.63(HDMI_1_CEC)
NetC152_1: C152.1 IC2.3(ESD_DISCH)
NetD22_C: D22.C R10.2
NetIC2_17: IC2.17(Utility) R9.1

Not connected (* = marked no-connect by the designer): IC2 12(HEAC+)* 13(HEAC-)* 34(FAULT)*

### Buses and harness runs
bus HDMI1[0..7]
bus HDMI_CTRL[0..3]
bus I2C_3_HDMI[0..1] = port I2C_3_HDMI[0..1]

### Layout directives
differential pair; differential pair class HDMI: HDMI_1_TXC_CON_N, HDMI_1_TXC_CON_P, HDMI_1_TXC_L_N, HDMI_1_TXC_L_P, HDMI_1_TXC_N, HDMI_1_TXC_P, HDMI_1_TXD0_CON_N, HDMI_1_TXD0_CON_P, HDMI_1_TXD0_L_N, HDMI_1_TXD0_L_P, HDMI_1_TXD0_N, HDMI_1_TXD0_P, HDMI_1_TXD1_CON_N, HDMI_1_TXD1_CON_P, HDMI_1_TXD1_L_N, HDMI_1_TXD1_L_P, HDMI_1_TXD1_N, HDMI_1_TXD1_P, HDMI_1_TXD2_CON_N, HDMI_1_TXD2_CON_P, HDMI_1_TXD2_L_N, HDMI_1_TXD2_L_P, HDMI_1_TXD2_N, HDMI_1_TXD2_P
net class 50Ohm: HDMI_1_CEC, HDMI_1_HPD, SODIMM_61_M, SODIMM_63_M

### Notes on the sheet
- WARNING: HDMI2C1-14HD is NRND.
  Different solution will be used in the next product releases.
- HDMI Connector
- Title
- Size:
- Date:
- A3
- Number:
- Time:
- Revision:
- Sheet
- of
- File:

### Library data of the parts
C7-C10 = C-X7R-100nF-16V-10%-0402: Capacitor Ceramic X7R 100nF 16V 10% 0402; Tolerance: 10%; Type: X7R; Value: 100nF
C151 C152 = C-X5R-1uF-16V-20%-0402: Capacitor Ceramic X5R 1uF 16V 20% 0402; Tolerance: 20%; Type: X5R; Value: 1uF
C185 = C-X7R-1nF-2KV-10%-1206: Capacitor Ceramic X7R 1nF 2KV 10% 1206; Tolerance: 10%; Type: X7R; Value: 1nF
D22 = D-BAT54-SOD523: Schottky Barrier Rectifier; Manufacturer Name: On Semi; Manufacturer Part No.: BAT54XV2T5G
IC2 = IC-ST-HDMI2C1-14HD: ESD protection and signal conditioning for HDMI™ 2.0 source interface; Manufacturer Name: STMicroelectronics; Manufacturer Part No.: HDMI2C1-14HD
L12 L38-L40 = L-Panasonic-EXC14CH120U-12R@100MHz-1000mA-25%: Common Mode Choke High Speed 12R 100mA; Tolerance: 25%; Rating: 100mA; Manufacturer Name: Panasonic; Manufacturer Part No.: EXC14CH120U; Value: 12R@100MHz
R6 R347 R348 = R-10K-63mW-5%-0402: Resistor 10 Kohm 63mW 5% 0402; Rating: 63mW; Tolerance: 5%; Value: 10K
R9 = R-0R-63mW-1%-0603: Resistor 0 ohm 63mW 1% 0603; Rating: 63mW; Tolerance: 1%; Value: 0R
R10 = R-27K-63mW-5%-0402: Resistor 27 Kohm 63mW 5% 0402; Rating: 63mW; Tolerance: 5%; Value: 27K
R11 R12 = R-1.8K-63mW-5%-0402: Resistor 1.8 Kohm 63mW 5% 0402; Rating: 63mW; Tolerance: 5%; Value: 1.8K
R96 = R-1M-250mW-5%-1206: Resistor 1 Mohm 250mW 5% 1206; Rating: 250mW; Tolerance: 5%; Value: 1M
RA11 = RA-22R-63mW-5%-1206-div: Resistor Array 22 R 63mW 5% 1206; Tolerance: 5%; Power Dissipation: 63mW; Value: 22R
X1 = CON-TE-2309409-2: as X1 on sheet Unused_SODIMM; Temperature Range: -40C to +125C; Package: DDR4-SODIMM-260; Manufacturer Part No.: 2309409-2
X21 = CON-FCI-10029449-111RLF: HDMI Connector Right Angle Vertical THT; Manufacturer Name: FCI; No. of ways: 19; Manufacturer Part No.: 10029449-111RLF

## Nets that join several sheets
+V1.8_SW: CAN (C2.2 C3.2 IC1.5 R3.1), USB_HUB (C32.2 IC8.1 R30.2), USB_Connectors (R15.2 R22.2 R350.1), Power_Switch (5 pins), Power_Supply (6 pins), PCI_Express (7 pins), Audio (9 pins), MIPI-DSI (8 pins), MIPI-CSI (11 pins), EEPROM (14 pins), USB_Debug (7 pins), Extension (X19.18 X20.26), HDMI (7 pins)
+V3.3: USB_HUB (6 pins), Power_Switch (39 pins), Power_Supply (R167.1 R185.1), PCI_Express (C142.2 C143.2 R228.2 T32.2)
+V3.3_DBG: Power_Switch (5 pins), USB_Debug (34 pins)
+V3.3_SW: Power_Switch (5 pins), SDCard (5 pins), Power_Supply (12 pins), Ethernet (X11.14 X11.16), PCI_Express (L3.2), MIPI-DSI (6 pins), MIPI-CSI (8 pins), Extension (X20.36), HDMI (C9.2 D22.A IC2.30)
+V5_SW: CAN (C1.2 C4.2 IC1.3 R60.2), USB_Connectors (17 pins), Power_Switch (6 pins), Power_Supply (C225.2 R186.2 X6.3), MIPI-DSI (6 pins), MIPI-CSI (C193.2 X16.21), Extension (X20.40), HDMI (C10.2 IC2.29)
+V_SUPPLY_FILT: Power_Switch (21 pins), Power_Supply (23 pins)
+V_SUPPLY_FILT_SW: Power_Switch (6 pins), Power_Supply (X6.1), MIPI-DSI (7 pins)
GND: CAN (11 pins), USB_HUB (44 pins), USB_Connectors (66 pins), Power_Switch (105 pins), SDCard (18 pins), JTAG (X8.3 X8.5), Power_Supply (143 pins), Ethernet (12 pins), PCI_Express (48 pins), Audio (43 pins), MIPI-DSI (15 pins), MIPI-CSI (30 pins), EEPROM (9 pins), USB_Debug (69 pins), Extension (9 pins), HDMI (16 pins)
GND_CHASSIS: USB_Connectors (12 pins), Power_Supply (6 pins), Ethernet (C138.2 R207.1 X11.S1 X11.S2), USB_Debug (X18.SH1 X18.SH2 X18.SH3 X18.SH4), HDMI (6 pins)
JTAG_1_VREF: JTAG (X1.7 X8.1), USB_Debug (6 pins)
PWR_1V8_MOCI: Power_Switch (L21.1), PWM_QSPI_SPI_ADC_UART_GPIO_I2C (TP18.1 X1.214)
ADC_1: PWM_QSPI_SPI_ADC_UART_GPIO_I2C (RA23.5), Extension (X20.1)
ADC_2: PWM_QSPI_SPI_ADC_UART_GPIO_I2C (RA23.6), Extension (X20.2)
ADC_3: PWM_QSPI_SPI_ADC_UART_GPIO_I2C (RA23.7), Extension (X20.3)
ADC_4: PWM_QSPI_SPI_ADC_UART_GPIO_I2C (RA23.8), Extension (X20.4)
CAN_2_RX: CAN (RA1.7), Extension (X19.2)
CAN_2_TX: CAN (RA1.6), Extension (X19.1)
CTRL_PWR_EN_MOCI: CAN (R7.1), USB_HUB (R61.1), Power_Switch (6 pins), PCI_Express (R230.1), MIPI-DSI (R291.2)
CTRL_RESET_MOCI#: USB_HUB (D19.C), Power_Switch (IC12.1 LED6.K R72.1 RA4.7), MIPI-DSI (X17.57), Extension (X20.38)
CTRL_SLEEP_MOCI#: CAN (R8.1), USB_HUB (R64.1), Power_Switch (RA4.6), PCI_Express (R231.1), MIPI-DSI (R292.2), Extension (X20.37)
CTRL_WAKE1_MICO#: Power_Switch (RA3.5), PCI_Express (R217.1), Extension (X20.39)
DBG_FORCE_OFF#: Power_Switch (R105.1 T9.2), USB_Debug (R293.2)
DBG_PWR_BTN#: Power_Switch (R119.1 T12.2), USB_Debug (R295.2)
DBG_RECOVERY#: Power_Switch (R124.1 T14.2), USB_Debug (R296.2)
DBG_RESET#: Power_Switch (R112.1 T10.2), USB_Debug (R294.2)
FTDI_JTAG_TCK: JTAG (R129.1), USB_Debug (IC34.1)
FTDI_JTAG_TDI: JTAG (R130.1), USB_Debug (IC34.2)
FTDI_JTAG_TDO: JTAG (R131.1), USB_Debug (IC34.3 R300.1)
FTDI_JTAG_TMS: JTAG (R132.1), USB_Debug (IC34.4)
FTDI_JTAG_TRST#: JTAG (R133.1), USB_Debug (T37.3)
GPIO_1: PWM_QSPI_SPI_ADC_UART_GPIO_I2C (RA7.5), Extension (X20.27)
GPIO_2: PWM_QSPI_SPI_ADC_UART_GPIO_I2C (RA7.6), Extension (X20.28)
GPIO_3: PWM_QSPI_SPI_ADC_UART_GPIO_I2C (RA7.7), Extension (X20.29)
GPIO_4: PWM_QSPI_SPI_ADC_UART_GPIO_I2C (RA7.8), Extension (X20.30)
GPIO_5_CSI: MIPI-CSI (R278.2), PWM_QSPI_SPI_ADC_UART_GPIO_I2C (RA8.5), Extension (R339.2)
GPIO_6_CSI: MIPI-CSI (R279.2), PWM_QSPI_SPI_ADC_UART_GPIO_I2C (RA8.6), Extension (R340.2)
GPIO_7_CSI: MIPI-CSI (R280.2), PWM_QSPI_SPI_ADC_UART_GPIO_I2C (RA8.7), Extension (R341.2)
GPIO_8_CSI: MIPI-CSI (R281.2), PWM_QSPI_SPI_ADC_UART_GPIO_I2C (RA8.8), Extension (R342.2)
I2C_1_SCL: USB_HUB (IC8.2), Power_Supply (R145.1 R177.1), PCI_Express (R210.1), Audio (IC27.2), MIPI-DSI (X17.6), EEPROM (IC30.6 IC50.2 R117.2 R263.2), Extension (X20.7)
I2C_1_SDA: USB_HUB (IC8.3), Power_Supply (R146.1 R180.1), PCI_Express (R211.1), Audio (IC27.3), MIPI-DSI (X17.4), EEPROM (IC30.5 IC50.1 R88.2 R264.2), Extension (X20.6)
I2C_3_HDMI_SCL: Extension (R346.2), HDMI (IC2.36 R347.2 RA11.7)
I2C_3_HDMI_SDA: Extension (R345.2), HDMI (IC2.1 R348.2 RA11.8)
I2C_4_CSI_SCL: MIPI-CSI (R271.2 R274.2 RA22.6), Extension (R344.2)
I2C_4_CSI_SDA: MIPI-CSI (R270.2 R275.2 RA22.7), Extension (R343.2)
I2S_2_BCLK: Audio (RA9.5), MIPI-DSI (X17.42)
I2S_2_D_IN: Audio (RA9.8), MIPI-DSI (X17.48)
I2S_2_D_OUT: Audio (RA9.7), MIPI-DSI (X17.46)
I2S_2_SYNC: Audio (RA9.6), MIPI-DSI (X17.44)
PWM_1: PWM_QSPI_SPI_ADC_UART_GPIO_I2C (RA14.8), Extension (X20.9)
PWM_2: PWM_QSPI_SPI_ADC_UART_GPIO_I2C (RA14.7), Extension (X20.10)
QSPI_1_CLK: PWM_QSPI_SPI_ADC_UART_GPIO_I2C (RA16.5), Extension (X19.4)
QSPI_1_CS2#: PWM_QSPI_SPI_ADC_UART_GPIO_I2C (RA17.7), Extension (X19.11)
QSPI_1_CS#: PWM_QSPI_SPI_ADC_UART_GPIO_I2C (RA16.6), Extension (X19.5)
QSPI_1_DQS: PWM_QSPI_SPI_ADC_UART_GPIO_I2C (RA17.8), Extension (X19.12)
QSPI_1_IO0: PWM_QSPI_SPI_ADC_UART_GPIO_I2C (RA16.7), Extension (X19.6)
QSPI_1_IO1: PWM_QSPI_SPI_ADC_UART_GPIO_I2C (RA16.8), Extension (X19.7)
QSPI_1_IO2: PWM_QSPI_SPI_ADC_UART_GPIO_I2C (RA17.5), Extension (X19.9)
QSPI_1_IO3: PWM_QSPI_SPI_ADC_UART_GPIO_I2C (RA17.6), Extension (X19.10)
SPI_1_CLK: PWM_QSPI_SPI_ADC_UART_GPIO_I2C (RA15.8), Extension (X20.22)
SPI_1_CS: PWM_QSPI_SPI_ADC_UART_GPIO_I2C (RA15.5), Extension (X20.25)
SPI_1_MISO: PWM_QSPI_SPI_ADC_UART_GPIO_I2C (RA15.7), Extension (X20.23)
SPI_1_MOSI: PWM_QSPI_SPI_ADC_UART_GPIO_I2C (RA15.6), Extension (X20.24)
UART_1_CTS: PWM_QSPI_SPI_ADC_UART_GPIO_I2C (RA19.5), Extension (X20.15)
UART_1_RTS: PWM_QSPI_SPI_ADC_UART_GPIO_I2C (RA19.6), Extension (X20.14)
UART_1_RXD: PWM_QSPI_SPI_ADC_UART_GPIO_I2C (RA19.8), Extension (X20.12)
UART_1_TXD: PWM_QSPI_SPI_ADC_UART_GPIO_I2C (RA19.7), Extension (X20.13)
UART_2_CTS: PWM_QSPI_SPI_ADC_UART_GPIO_I2C (RA20.5), Extension (X19.17)
UART_2_RTS: PWM_QSPI_SPI_ADC_UART_GPIO_I2C (RA20.6), Extension (X19.16)
UART_2_RXD: PWM_QSPI_SPI_ADC_UART_GPIO_I2C (RA20.8), Extension (X19.14)
UART_2_TXD: PWM_QSPI_SPI_ADC_UART_GPIO_I2C (RA20.7), Extension (X19.15)
UART_3_RXD: USB_Debug (R327.1 RA18.8), Extension (R333.2)
UART_3_TXD: USB_Debug (R328.1 RA18.7), Extension (R334.2)
UART_4_RXD: USB_Debug (R325.1 RA18.6), Extension (R335.2)
UART_4_TXD: USB_Debug (R326.1 RA18.5), Extension (R336.2)
USB_1_D_N: USB_HUB (X1.163), USB_Connectors (L2.2)
USB_1_D_P: USB_HUB (X1.165), USB_Connectors (L2.1)
USB_1_EN: USB_HUB (RA2.8), USB_Connectors (IC4.9 R16.2)
USB_1_ID: USB_HUB (RA2.5), USB_Connectors (IC5.9 R22.1 TP13.1)
USB_1_OC#: USB_HUB (RA2.7), USB_Connectors (IC4.4 R15.1)
USB_1_VBUS: USB_HUB (RA2.6), USB_Connectors (R13.1 R14.1)
USBH2_D_N: USB_HUB (IC7.9), USB_Connectors (L11.1)
USBH2_D_P: USB_HUB (IC7.8), USB_Connectors (L11.2)
USBH2_PRT_CTL: USB_HUB (IC7.35), USB_Connectors (IC3.9 R29.1)
USBH2_SSRX_N: USB_HUB (IC7.14), USB_Connectors (L9.1)
USBH2_SSRX_P: USB_HUB (IC7.13), USB_Connectors (L9.2)
USBH2_SSTX_N: USB_HUB (C34.1), USB_Connectors (L10.1)
USBH2_SSTX_P: USB_HUB (C33.1), USB_Connectors (L10.2)
USBH3_D_N: USB_HUB (IC7.18), USB_Connectors (L7.2)
USBH3_D_P: USB_HUB (IC7.17), USB_Connectors (L7.1)
USBH3_PRT_CTL: USB_HUB (IC7.34), USB_Connectors (IC6.9 R25.1)
USBH3_SSRX_N: USB_HUB (IC7.23), USB_Connectors (L5.1)
USBH3_SSRX_P: USB_HUB (IC7.22), USB_Connectors (L5.2)
USBH3_SSTX_N: USB_HUB (C38.1), USB_Connectors (L6.1)
USBH3_SSTX_P: USB_HUB (C36.1), USB_Connectors (L6.2)
USBH4_D_N: USB_HUB (IC7.25), PCI_Express (X13.36)
USBH4_D_P: USB_HUB (IC7.24), PCI_Express (X13.38)

## Assembly variants
Dahlia Carrier Board V1.1A.001: not fitted C46 C57 C73 C77 C141 C246 C265 C266 C267 C268 C269 C270 C272 D31 D38 IC12 L8 L18 L19 L21 R1 R7 R18 R19 R21 R42 R45 R46 R49 R54 R55 R61 R69 R73 R76 R83 R93 R94 R103 R111 R118 R125 R149 R153 R169 R170 R183 R187 R188 R189 R194 R195 R206 R214 R230 R233 R251 R254 R265 R291 R333 R334 R335 R336 R339 R340 R341 R342 R345 R346 R352 R353 R354 R407 R409 R411 SW2 SW4 SW6 X6 X15